# Altium schematic sheet PIC.SchDoc
size A
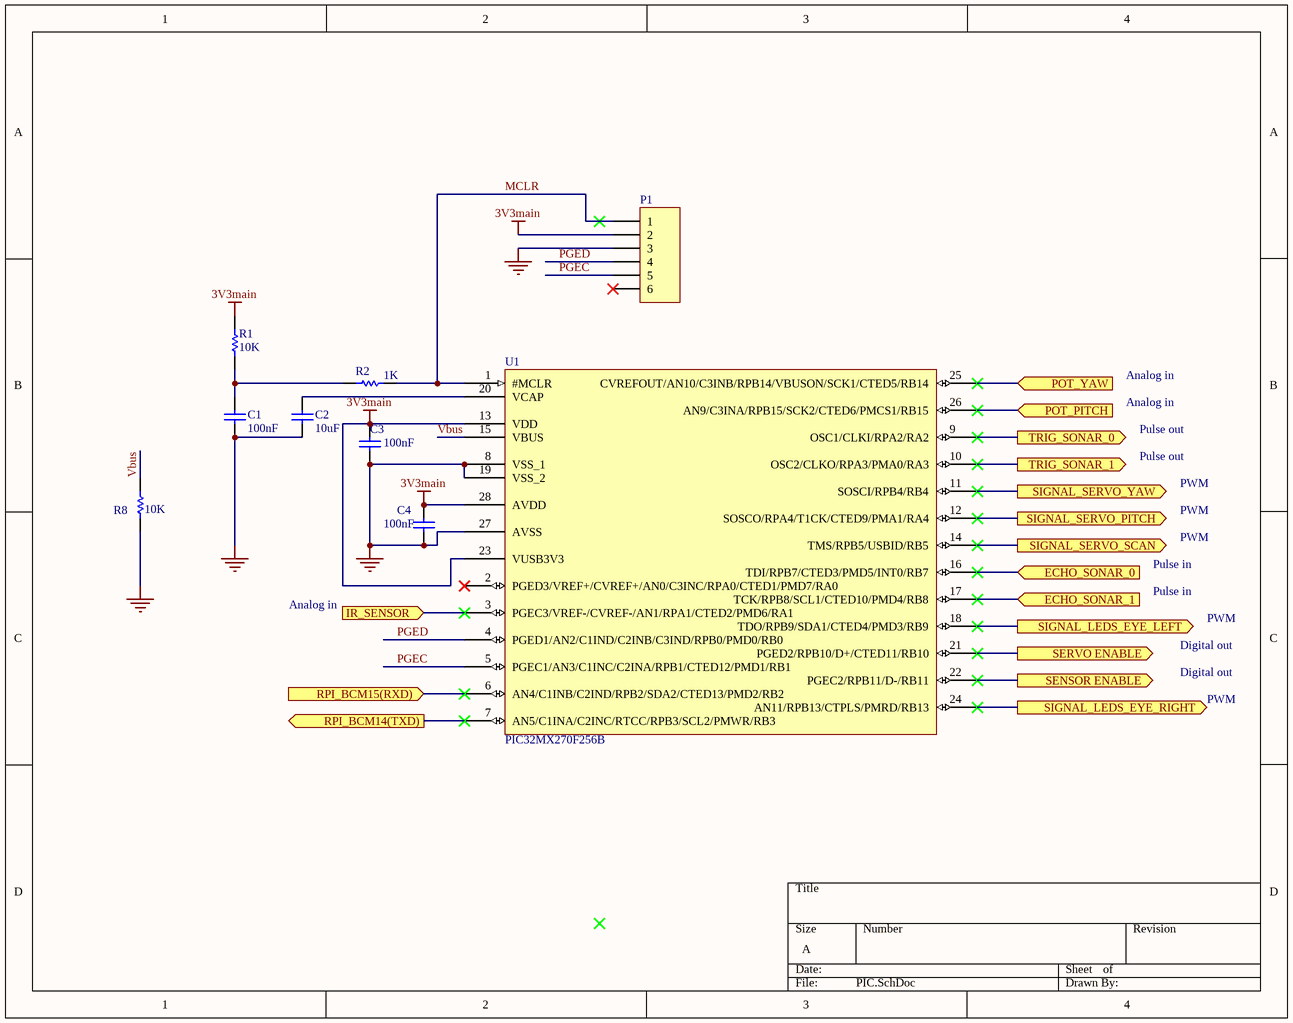
[diagram p0: PIC.SchDoc]

## Parts
C1  100nF  [1608 / 0603]
C2  10uF  [1608 / 0603]
C3  100nF  [1608 / 0603]
C4  100nF  [1608 / 0603]
P1  RJ11 Debug  [RJ11]  (value not drawn)
R1  10K  [1608 / 0603]
R2  1K  [1608 / 0603]
R8  10K  [1608 / 0603]
U1  PIC32MX270F256B  [SOIC28]

## Ports
ECHO_SONAR_0 (in), ECHO_SONAR_1 (in), IR_SENSOR (in), POT_PITCH (in), POT_YAW (in), RPI_BCM14(TXD) (out), RPI_BCM15(RXD) (in), SENSOR ENABLE (out), SERVO ENABLE (out), SIGNAL_LEDS_EYE_LEFT (out), SIGNAL_LEDS_EYE_RIGHT (out), SIGNAL_SERVO_PITCH (out), SIGNAL_SERVO_SCAN (out), SIGNAL_SERVO_YAW (out), TRIG_SONAR_0 (out), TRIG_SONAR_1 (out)

## Nets
3V3main: C3.2 C4.2 P1.2 R1.2 U1.13(VDD) U1.23(VUSB3V3) U1.28(AVDD)
GND: C1.1 C2.1 C3.1 C4.1 P1.3 R8.1 U1.8(VSS_1) U1.19(VSS_2) U1.27(AVSS)
ECHO_SONAR_0: U1.16(TDI/RPB7/CTED3/PMD5/INT0/RB7) ; port ECHO_SONAR_0
ECHO_SONAR_1: U1.17(TCK/RPB8/SCL1/CTED10/PMD4/RB8) ; port ECHO_SONAR_1
IR_SENSOR: U1.3(PGEC3/VREF-/CVREF-/AN1/RPA1/CTED2/PMD6/RA1) ; port IR_SENSOR
MCLR: P1.1 R2.2 U1.1(#MCLR)
PGEC: P1.5 U1.5(PGEC1/AN3/C1INC/C2INA/RPB1/CTED12/PMD1/RB1)
PGED: P1.4 U1.4(PGED1/AN2/C1IND/C2INB/C3IND/RPB0/PMD0/RB0)
POT_PITCH: U1.26(AN9/C3INA/RPB15/SCK2/CTED6/PMCS1/RB15) ; port POT_PITCH
POT_YAW: U1.25(CVREFOUT/AN10/C3INB/RPB14/VBUSON/SCK1/CTED5/RB14) ; port POT_YAW
RPI_BCM14(TXD): U1.7(AN5/C1INA/C2INC/RTCC/RPB3/SCL2/PMWR/RB3) ; port RPI_BCM14(TXD)
RPI_BCM15(RXD): U1.6(AN4/C1INB/C2IND/RPB2/SDA2/CTED13/PMD2/RB2) ; port RPI_BCM15(RXD)
SENSOR ENABLE: U1.22(PGEC2/RPB11/D-/RB11) ; port SENSOR ENABLE
SERVO ENABLE: U1.21(PGED2/RPB10/D+/CTED11/RB10) ; port SERVO ENABLE
SIGNAL_LEDS_EYE_LEFT: U1.18(TDO/RPB9/SDA1/CTED4/PMD3/RB9) ; port SIGNAL_LEDS_EYE_LEFT
SIGNAL_LEDS_EYE_RIGHT: U1.24(AN11/RPB13/CTPLS/PMRD/RB13) ; port SIGNAL_LEDS_EYE_RIGHT
SIGNAL_SERVO_PITCH: U1.12(SOSCO/RPA4/T1CK/CTED9/PMA1/RA4) ; port SIGNAL_SERVO_PITCH
SIGNAL_SERVO_SCAN: U1.14(TMS/RPB5/USBID/RB5) ; port SIGNAL_SERVO_SCAN
SIGNAL_SERVO_YAW: U1.11(SOSCI/RPB4/RB4) ; port SIGNAL_SERVO_YAW
TRIG_SONAR_0: U1.9(OSC1/CLKI/RPA2/RA2) ; port TRIG_SONAR_0
TRIG_SONAR_1: U1.10(OSC2/CLKO/RPA3/PMA0/RA3) ; port TRIG_SONAR_1
Vbus: R8.2 U1.15(VBUS)
NetC1_2: C1.2 R1.1 R2.1
NetC2_2: C2.2 U1.20(VCAP)

Not connected (* = marked no-connect by the designer): P1 6*; U1 2(PGED3/VREF+/CVREF+/AN0/C3INC/RPA0/CTED1/PMD7/RA0)*

## Notes on the sheet
- Analog in
- Pulse out
- PWM
- Pulse in
- Digital out

## Library data of the parts
C1-C4 = Cap: Capacitor; Value: 100pF; Published: 8-Jun-2000; LatestRevisionDate: 17-Jul-2002; LatestRevisionNote: Re-released for DXP Platform.; PackageReference: RAD-0.3; Publisher: Altium Limited; PackageDescription: Radial Cap, Thru-Hole; 2 Leads; 0.3 in Pin Spacing
P1 = Header 6: RJ11 Connector; fabricant: MOLEX; fournisseur: Farnell; reffabricant: 95009-7661; reffournisseur: 2076092; LatestRevisionDate: 17-Jul-2002; LatestRevisionNote: Re-released for DXP Platform.; Publisher: Altium Limited
R1 R8 = Res1: Resistor; Value: 1K; Published: 8-Jun-2000; LatestRevisionDate: 17-Jul-2002; LatestRevisionNote: Re-released for DXP Platform.; PackageReference: AXIAL-0.3; Publisher: Altium Limited; PackageDescription: Axial Device, Thru-Hole; 2 Leads; 0.3 in Pin Spacing
R2 = Res1: Resistor; Published: 8-Jun-2000; LatestRevisionDate: 17-Jul-2002; LatestRevisionNote: Re-released for DXP Platform.; PackageReference: AXIAL-0.3; Publisher: Altium Limited; PackageDescription: Axial Device, Thru-Hole; 2 Leads; 0.3 in Pin Spacing; Value: 1K
U1 = PIC32MX270F256B: fournisseur: Farnell; reffournisseur: 2419680; fabricant: Microchip; reffabricant: PIC32MX270F256B-50I/SO